# Altium project fMUX_MB.PrjPCB (part 5 of 6)

## Sheet PHY_RJ45.SchDoc: FPGA Motherboard for Digital Multiplexed Readout, McGill U.
size Letter; DocumentNumber: DfMUX11; Revision: Rev0, Prototype; SheetNumber: 11; SheetTotal: 27; PageSetup: Record=PageOptions|CenterHorizontal=True|CenterVertical=True|PrintScale=1.27|XCorrection=1.00|YCorrection=1.00|PrintKind=0|BorderSize=5000000|LeftOffset=0|BottomOffset=0|Orientation=2|PaperLength=1000|PaperWidth=1000|Scale=100|PaperSource=15|PrintQuality=1200|MediaType=1|DitherType=10|PaperKind=Tabloid|PrintScaleMode=1
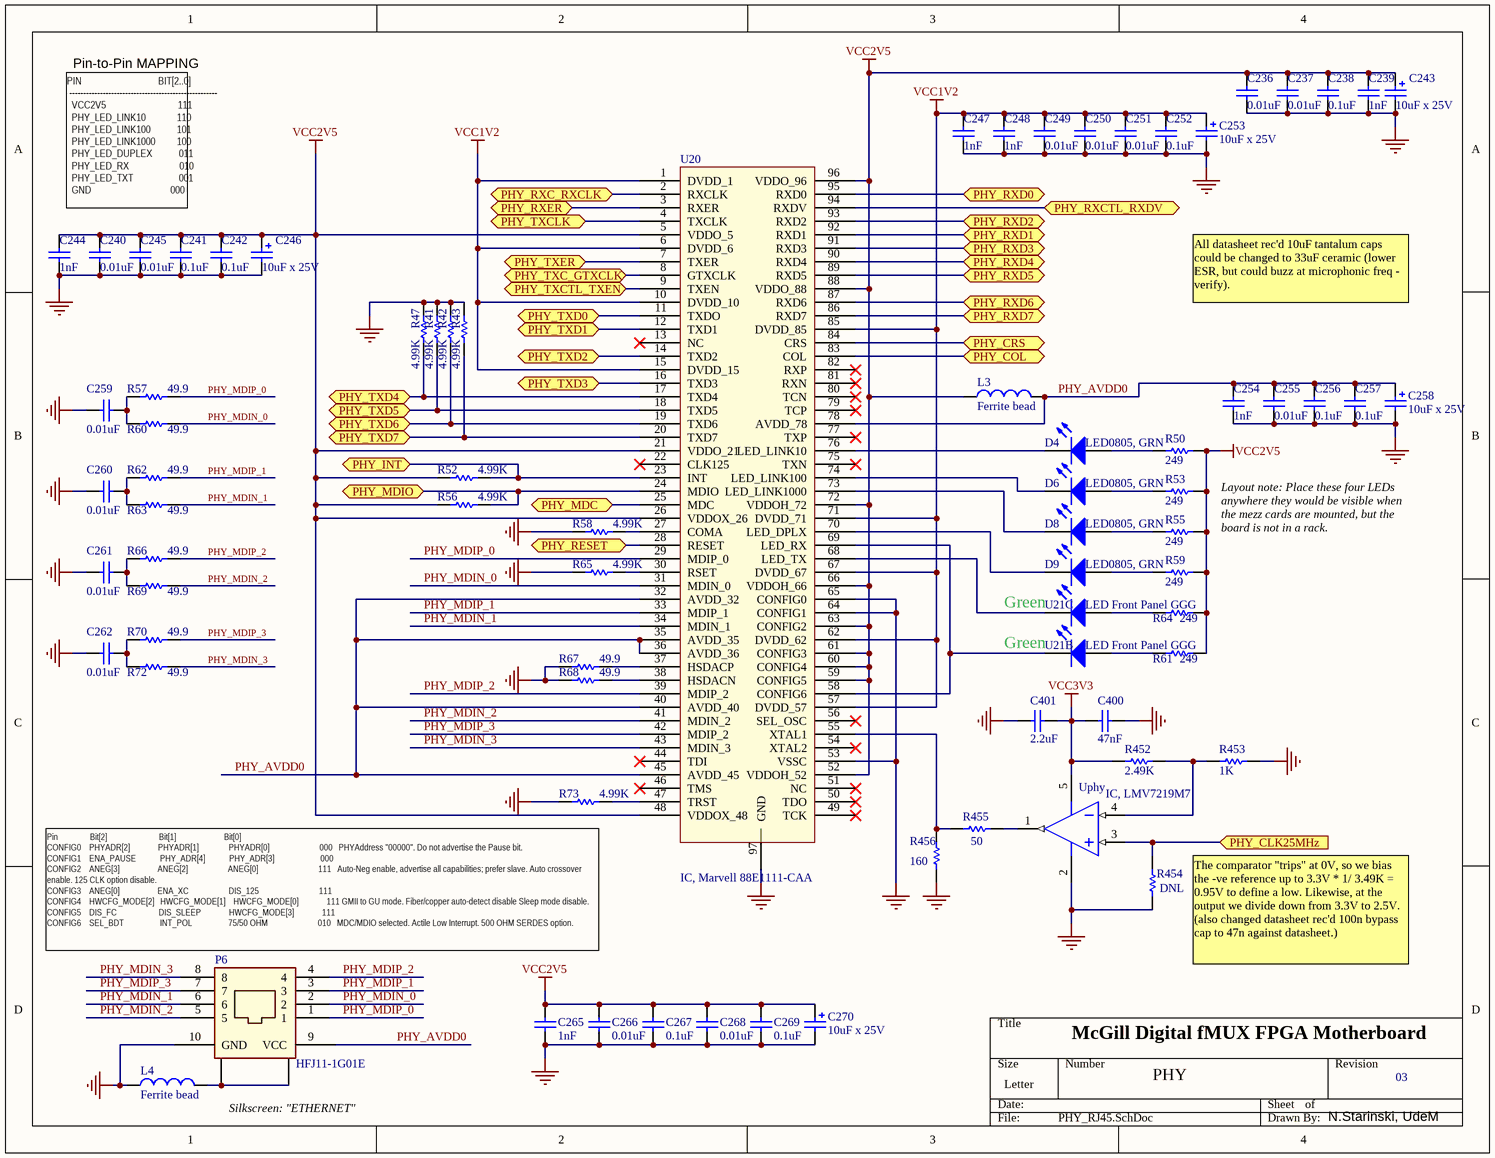
[diagram p26: PHY_RJ45.SchDoc]

### Parts
C236  0.01uF  [CC1005-0402]
C237  0.01uF  [CC1005-0402]
C238  0.1uF  [CC1608-0603]
C239  1nF  [CC1005-0402]
C240  0.01uF  [CC1005-0402]
C241  0.1uF  [CC1608-0603]
C242  0.1uF  [CC1608-0603]
C243  10uF x 25V  [TC6032-2412]
C244  1nF  [CC1005-0402]
C245  0.01uF  [CC1005-0402]
C246  10uF x 25V  [TC6032-2412]
C247  1nF  [CC1005-0402]
C248  1nF  [CC1005-0402]
C249  0.01uF  [CC1005-0402]
C250  0.01uF  [CC1005-0402]
C251  0.01uF  [CC1005-0402]
C252  0.1uF  [CC1608-0603]
C253  10uF x 25V  [TC6032-2412]
C254  1nF  [CC1005-0402]
C255  0.01uF  [CC1005-0402]
C256  0.1uF  [CC1608-0603]
C257  0.1uF  [CC1608-0603]
C258  10uF x 25V  [TC6032-2412]
C259  0.01uF  [CC1608-0603]
C260  0.01uF  [CC1608-0603]
C261  0.01uF  [CC1608-0603]
C262  0.01uF  [CC1608-0603]
C265  1nF  [CC1005-0402]
C266  0.01uF  [CC1005-0402]
C267  0.1uF  [CC1608-0603]
C268  0.01uF  [CC1005-0402]
C269  0.1uF  [CC1608-0603]
C270  10uF x 25V  [TC6032-2412]
C400  47nF  [CC1005-0402]
C401  2.2uF  [CC3225-1210]
D4  LED0805, GRN  [SMD _LED]
D6  LED0805, GRN  [SMD _LED]
D8  LED0805, GRN  [SMD _LED]
D9  LED0805, GRN  [SMD _LED]
L3  Ferrite bead  [INDC2012-0805]
L4  Ferrite bead  [INDC2012-0805]
P6  HFJ11-1G01E  [HALO_RJ45]
R41  4.99K  [CR1608-0603]
R42  4.99K  [CR1608-0603]
R43  4.99K  [CR1608-0603]
R47  4.99K  [CR1608-0603]
R50  249  [CR1608-0603]
R52  4.99K  [CR1608-0603]
R53  249  [CR1608-0603]
R55  249  [CR1608-0603]
R56  4.99K  [CR1608-0603]
R57  49.9  [CR1608-0603]
R58  4.99K  [CR1608-0603]
R59  249  [CR1608-0603]
R60  49.9  [CR1608-0603]
R61  249  [CR1608-0603]
R62  49.9  [CR1608-0603]
R63  49.9  [CR1608-0603]
R64  249  [CR1608-0603]
R65  4.99K  [CR1608-0603]
R66  49.9  [CR1608-0603]
R67  49.9  [CR1608-0603]
R68  49.9  [CR1608-0603]
R69  49.9  [CR1608-0603]
R70  49.9  [CR1608-0603]
R72  49.9  [CR1608-0603]
R73  4.99K  [CR1608-0603]
R452  2.49K  [CR1608-0603]
R453  1K  [CR1608-0603]
R454  DNL  [CR1608-0603]
R455  50  [CR1608-0603]
R456  160  [CR1608-0603]
U20  IC, Marvell 88E1111-CAA  [BCC_96]
U21  LED Front Panel GGG  [LED_Tri_]  (parts B,C of 3)
Uphy  IC, LMV7219M7  [MAA05A]

### Ports
PHY_CLK25MHz (in), PHY_COL (bidir), PHY_CRS (bidir), PHY_INT (bidir), PHY_MDC (bidir), PHY_MDIO (bidir), PHY_RESET (bidir), PHY_RXC_RXCLK (bidir), PHY_RXCTL_RXDV (bidir), PHY_RXD0 (bidir), PHY_RXD1 (bidir), PHY_RXD2 (bidir), PHY_RXD3 (bidir), PHY_RXD4 (bidir), PHY_RXD5 (bidir), PHY_RXD6 (bidir), PHY_RXD7 (bidir), PHY_RXER (bidir), PHY_TXC_GTXCLK (bidir), PHY_TXCLK (bidir), PHY_TXCTL_TXEN (bidir), PHY_TXD0 (bidir), PHY_TXD1 (bidir), PHY_TXD2 (bidir), PHY_TXD3 (bidir), PHY_TXD4 (bidir), PHY_TXD5 (bidir), PHY_TXD6 (bidir), PHY_TXD7 (bidir), PHY_TXER (bidir)

### Nets
GND: C236.1 C237.1 C238.1 C239.1 C240.1 C241.1 C242.1 C243.2 C244.1 C245.1 C246.2 C247.1 C248.1 C249.1 C250.1 C251.1 C252.1 C253.2 C254.1 C255.1 C256.1 C257.1 C258.2 C259.1 C260.1 C261.1 C262.1 C265.1 C266.1 C267.1 C268.1 C269.1 C270.2 C400.2 C401.2 L4.1 P6.10(GND) R41.2 R42.2 R43.2 R47.2 R58.1 R65.1 R67.1 R68.1 R73.1 R453.2 R454.1 R456.1 U20.53(VSSC) U20.64(CONFIG1) U20.65(CONFIG0) U20.97(GND) Uphy.2(V-)
VCC1V2: C247.2 C248.2 C249.2 C250.2 C251.2 C252.2 C253.1 U20.1(DVDD_1) U20.6(DVDD_6) U20.10(DVDD_10) U20.15(DVDD_15) U20.57(DVDD_57) U20.62(DVDD_62) U20.67(DVDD_67) U20.71(DVDD_71) U20.85(DVDD_85)  [project net Vout3]
VCC2V5: C236.2 C237.2 C238.2 C239.2 C240.2 C241.2 C242.2 C243.1 C244.2 C245.2 C246.1 C265.2 C266.2 C267.2 C268.2 C269.2 C270.1 L3.1 R50.2 R52.1 R53.2 R55.2 R56.1 R59.2 R61.2 R64.2 U20.5(VDDO_5) U20.21(VDDO_21) U20.26(VDDOX_26) U20.48(VDDOX_48) U20.52(VDDOH_52) U20.59(CONFIG5) U20.60(CONFIG4) U20.61(CONFIG3) U20.63(CONFIG2) U20.66(VDDOH_66) U20.72(VDDOH_72) U20.88(VDDO_88) U20.96(VDDO_96)  [project net Vout2]
VCC3V3: C400.1 C401.1 R452.1 Uphy.5(V+)
PHY_AVDD0: C254.2 C255.2 C256.2 C257.2 C258.1 L3.2 P6.9(VCC) U20.32(AVDD_32) U20.35(AVDD_35) U20.36(AVDD_36) U20.40(AVDD_40) U20.45(AVDD_45) U20.78(AVDD_78)  [project net PHY_AVDD0_11]
PHY_COL: U20.83(COL) ; port PHY_COL
PHY_CRS: U20.84(CRS) ; port PHY_CRS
PHY_INT: R52.2 U20.23(INT) ; port PHY_INT
PHY_MDC: U20.25(MDC) ; port PHY_MDC
PHY_MDIN_0: P6.2 R60.2 U20.31(MDIN_0)  [project net PHY_MDIN_0_11]
PHY_MDIN_1: P6.6 R63.2 U20.34(MDIN_1)  [project net PHY_MDIN_1_11]
PHY_MDIN_2: P6.5 R69.2 U20.41(MDIN_2)  [project net PHY_MDIN_2_11]
PHY_MDIN_3: P6.8 R72.2 U20.43(MDIN_3)  [project net PHY_MDIN_3_11]
PHY_MDIO: R56.2 U20.24(MDIO) ; port PHY_MDIO
PHY_MDIP_0: P6.1 R57.2 U20.29(MDIP_0)  [project net PHY_MDIP_0_11]
PHY_MDIP_1: P6.3 R62.2 U20.33(MDIP_1)  [project net PHY_MDIP_1_11]
PHY_MDIP_2: P6.4 R66.2 U20.39(MDIP_2)  [project net PHY_MDIP_2_11]
PHY_MDIP_3: P6.7 R70.2 U20.42(MDIP_2)  [project net PHY_MDIP_3_11]
PHY_RESET: U20.28(RESET) ; port PHY_RESET
PHY_RXCTL_RXDV: U20.94(RXDV) ; port PHY_RXCTL_RXDV
PHY_RXD0: U20.95(RXD0) ; port PHY_RXD0
PHY_RXD1: U20.92(RXD1) ; port PHY_RXD1
PHY_RXD2: U20.93(RXD2) ; port PHY_RXD2
PHY_RXD3: U20.91(RXD3) ; port PHY_RXD3
PHY_RXD4: U20.90(RXD4) ; port PHY_RXD4
PHY_RXD5: U20.89(RXD5) ; port PHY_RXD5
PHY_RXD6: U20.87(RXD6) ; port PHY_RXD6
PHY_RXD7: U20.86(RXD7) ; port PHY_RXD7
PHY_RXER: U20.3(RXER) ; port PHY_RXER
PHY_TXC_GTXCLK: U20.8(GTXCLK) ; port PHY_TXC_GTXCLK
PHY_TXCTL_TXEN: U20.9(TXEN) ; port PHY_TXCTL_TXEN
PHY_TXD0: U20.11(TXDO) ; port PHY_TXD0
PHY_TXD1: U20.12(TXD1) ; port PHY_TXD1
PHY_TXD2: U20.14(TXD2) ; port PHY_TXD2
PHY_TXD3: U20.16(TXD3) ; port PHY_TXD3
PHY_TXD4: R47.1 U20.17(TXD4) ; port PHY_TXD4
PHY_TXD5: R41.1 U20.18(TXD5) ; port PHY_TXD5
PHY_TXD6: R42.1 U20.19(TXD6) ; port PHY_TXD6
PHY_TXD7: R43.1 U20.20(TXD7) ; port PHY_TXD7
PHY_TXER: U20.7(TXER) ; port PHY_TXER
SYSCLK_25MHZ: R454.2 Uphy.3(IN+) ; port PHY_CLK25MHz
NetC259_2: C259.2 R57.1 R60.1
NetC260_2: C260.2 R62.1 R63.1
NetC261_2: C261.2 R66.1 R69.1
NetC262_2: C262.2 R70.1 R72.1
NetD4_1: D4.1(A) R50.1
NetD4_2: D4.2(K) U20.76(LED_LINK10)
NetD6_1: D6.1(A) R53.1
NetD6_2: D6.2(K) U20.74(LED_LINK100)
NetD8_1: D8.1(A) R55.1
NetD8_2: D8.2(K) U20.73(LED_LINK1000)
NetD9_1: D9.1(A) R59.1
NetD9_2: D9.2(K) U20.70(LED_DPLX)
NetL4_2: L4.2 P6.11(GND) P6.12(GND)
NetR58_2: R58.2 U20.27(COMA)
NetR61_1: R61.1 U21.A2(A)
NetR64_1: R64.1 U21.A3(A)
NetR65_2: R65.2 U20.30(RSET)
NetR67_2: R67.2 U20.37(HSDACP)
NetR68_2: R68.2 U20.38(HSDACN)
NetR73_2: R73.2 U20.47(TRST)
NetR452_2: R452.2 R453.1 Uphy.4(IN-)
NetR455_1: R455.1 R456.2 U20.55(XTAL1)
NetR455_2: R455.2 Uphy.1(OUT)
NetU1_F18: U20.2(RXCLK) ; port PHY_RXC_RXCLK
NetU1_H19: U20.4(TXCLK) ; port PHY_TXCLK
NetU20_58: U20.58(CONFIG6) U20.69(LED_RX) U21.K2(K)
NetU20_68: U20.68(LED_TX) U21.K3(K)

Not connected (* = marked no-connect by the designer): U20 13(NC)* 22(CLK125)* 44(TDI)* 46(TMS)* 49(TCK)* 50(TDO)* 51(NC)* 54(XTAL2)* 56(SEL_OSC)* 75(TXN)* 77(TXP)* 79(TCP)* 80(TCN)* 81(RXN)* 82(RXP)*

### Notes on the sheet
- Pin-to-Pin MAPPING
- PIN                                BIT[2..0]
  -----------------------------------------------------
  VCC2V5                              111
  PHY_LED_LINK10             110
  PHY_LED_LINK100           101
  PHY_LED_LINK1000         100
  PHY_LED_DUPLEX           011
  PHY_LED_RX                     010
  PHY_LED_TXT                   001
  GND                                 000
- All datasheet rec'd 10uF tantalum caps could be changed to 33uF ceramic (lower ESR, but could buzz at microphonic freq - verify).
- Layout note: Place these four LEDs anywhere they would be visible when the mezz cards are mounted, but the board is not in a rack.
- Green
- (near U21) Green
- Pin                Bit[2]                          Bit[1]                        Bit[0]
  CONFIG0    PHYADR[2]              PHYADR[1]               PHYADR[0]                         000   PHYAddress "00000". Do not advertise the Pause bit.
  CONFIG1    ENA_PAUSE            PHY_ADR[4]            PHY_ADR[3]                       000
  CONFIG2    ANEG[3]                   ANEG[2]                    ANEG[0]                              111   Auto-Neg enable, advertise all capabilities; prefer slave. Auto crossover enable. 125 CLK option disable.
  CONFIG3    ANEG[0]                   ENA_XC                    DIS_125                              111
  CONFIG4    HWCFG_MODE[2]   HWCFG_MODE[1]    HWCFG_MODE[0]              111	GMII to GU mode. Fiber/copper auto-detect disable Sleep mode disable.
  CONFIG5    DIS_FC                     DIS_SLEEP              HWCFG_MODE[3]              111
  CONFIG6    SEL_BDT                  INT_POL                  75/50 OHM                         010   MDC/MDIO selected. Actile Low Interrupt. 500 OHM SERDES option.
- (near R454) The comparator "trips" at 0V, so we bias the -ve reference up to 3.3V * 1/ 3.49K = 0.95V to define a low. Likewise, at the output we divide down from 3.3V to 2.5V. (also changed datasheet rec'd 100n bypass cap to 47n against datasheet.)
- McGill Digital fMUX FPGA Motherboard
- Silkscreen: "ETHERNET"
- PHY
- 03
- N.Starinski, UdeM

### Library data of the parts
C236-C242 C244 C245 C247-C252 C254-C257 C259-C262 C265-C269 C400 = Cap Semi: Capacitor (Semiconductor SIM Model); Published: 8-Jun-2000; LatestRevisionDate: 17-Jul-2002; LatestRevisionNote: Re-released for DXP Platform.; PackageReference: C1206; Publisher: Altium Limited
C243 C246 C253 C258 C270 = Cap Pol3: CAP POL B45197A5106K309; Published: 8-Jun-2000; LatestRevisionDate: 17-Jul-2002; LatestRevisionNote: Re-released for DXP Platform.; PackageReference: C0805; Publisher: Altium Limited
C401 = Cap Semi: Capacitor (use 1206 footprint); Published: 8-Jun-2000; LatestRevisionDate: 17-Jul-2002; LatestRevisionNote: Re-released for DXP Platform.; PackageReference: C1206; Publisher: Altium Limited
D4 D6 D8 D9 = LED3: LED 0805 LTST-C170GKT; Published: 8-Jun-2000; LatestRevisionDate: 17-Dec-2003; LatestRevisionNote: PCB Footprint replaced.; Publisher: Altium Limited
L3 L4 = Inductor: Inductor SM 0805; Code_IEC: 1005; Published: 8-Jun-2000; LatestRevisionDate: 17-Jul-2002; LatestRevisionNote: Re-released for DXP Platform.; PackageReference: 0402-A; Publisher: Altium Limited; Code_JEITA: 0402
P6 = HFJ11-1G01E: Gigabit HALO RJ45
R41-R43 R47 R50 R52 R53 R55-R70 R72 R73 R452 R453 R455 R456 = Res Semi: Resistor 0603; Published: 8-Jun-2000; LatestRevisionDate: 17-Jul-2002; LatestRevisionNote: Re-released for DXP Platform.; Publisher: Altium Limited
R454 = Res Semi: Semiconductor Resistor; Published: 8-Jun-2000; LatestRevisionDate: 17-Jul-2002; LatestRevisionNote: Re-released for DXP Platform.; Publisher: Altium Limited
U20 = M88E1111-CAA: PHY 10/100/1000 Alaska Single-Port Gigabit Transceiver
U21 = LED_Tri: 564-0200-222F
Uphy = LMV7219: Voltage Comparator

## Sheet fMuxBoardOverview.SchDoc: Overview of fMux MotherBoard
size C; Author: Matt.Dobbs@McGill.ca; Revision: 3, Oct 2007; PageSetup: Record=PageOptions|CenterHorizontal=True|CenterVertical=True|PrintScale=0.54|XCorrection=1.00|YCorrection=1.00|PrintKind=2|BorderSize=5000000|LeftOffset=0|BottomOffset=0|Orientation=2|PaperLength=1000|PaperWidth=1000|Scale=100|PaperSource=15|PrintQuality=1200|MediaType=1|DitherType=10|PaperKind=Letter|PrintScaleMode=1
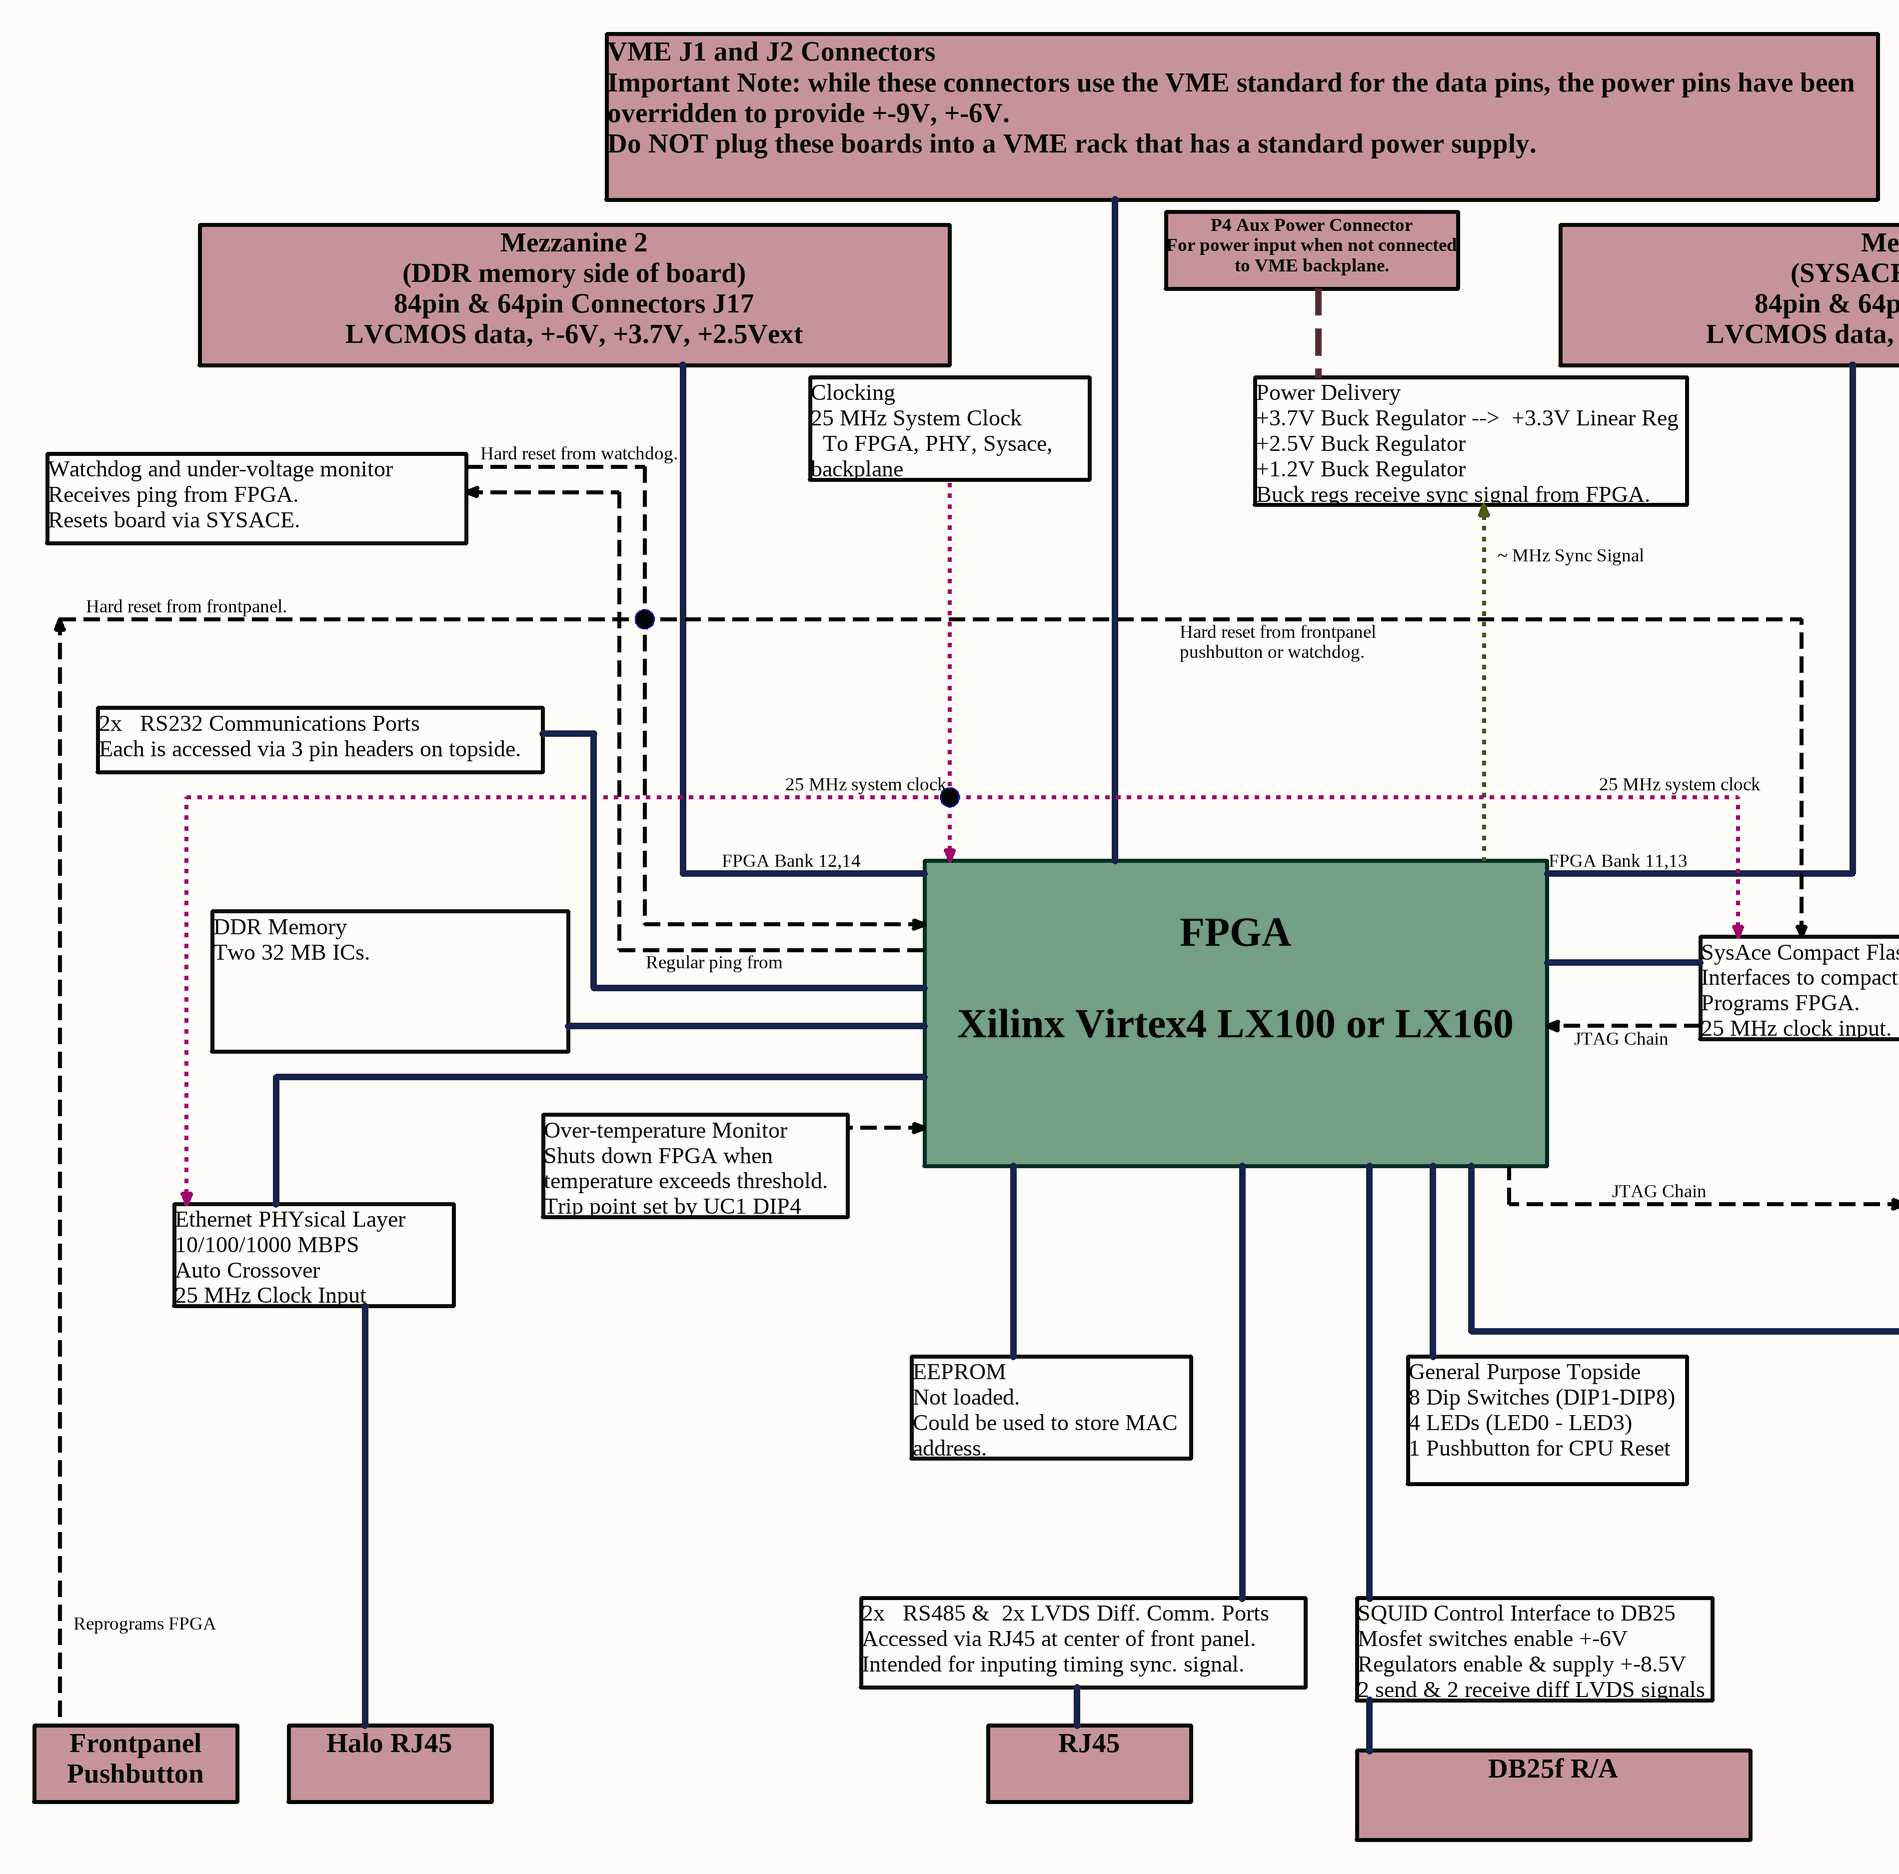
[diagram p27: fMuxBoardOverview.SchDoc, left]
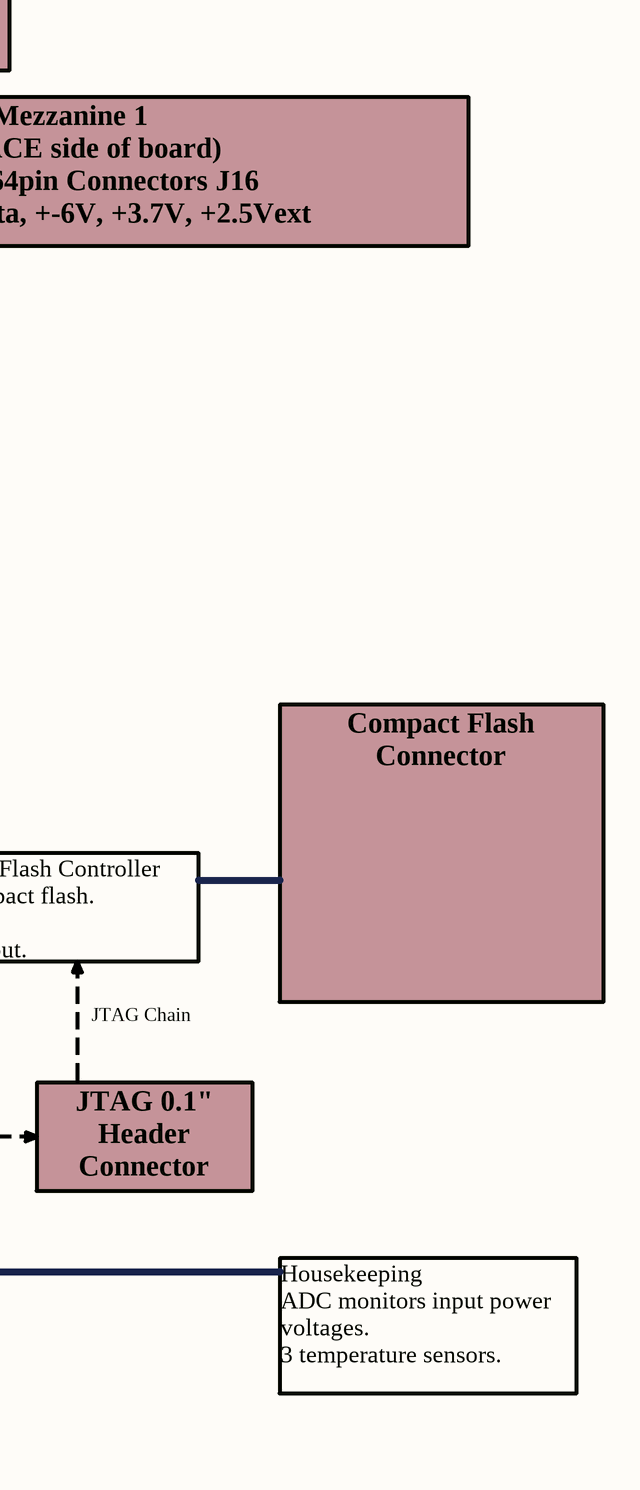
[diagram p28: fMuxBoardOverview.SchDoc, right]

### Notes on the sheet
- VME J1 and J2 Connectors
  Important Note: while these connectors use the VME standard for the data pins, the power pins have been overridden to provide +-9V, +-6V.
  Do NOT plug these boards into a VME rack that has a standard power supply.
- P4 Aux Power Connector
  For power input when not connected to VME backplane.
- Mezzanine 2
  (DDR memory side of board)
  84pin & 64pin Connectors J17
  LVCMOS data, +-6V, +3.7V, +2.5Vext
- Mezzanine 1
  (SYSACE side of board)
  84pin & 64pin Connectors J16
  LVCMOS data, +-6V, +3.7V, +2.5Vext
- Hard reset from watchdog.
- Clocking
  25 MHz System Clock
  To FPGA, PHY, Sysace, backplane
  Sourced from half size (DIP8) socket or backplane.
  To/from backplane as LVCMOS and/or LVDS.
  User Clock to FPGA (not normally used)
- Power Delivery
  +3.7V Buck Regulator -->  +3.3V Linear Reg
  +2.5V Buck Regulator
  +1.2V Buck Regulator
  Buck regs receive sync signal from FPGA.
- Watchdog and under-voltage monitor
  Receives ping from FPGA.
  Resets board via SYSACE.
- ~ MHz Sync Signal
- Hard reset from frontpanel.
- Hard reset from frontpanel pushbutton or watchdog.
- 2x   RS232 Communications Ports
  Each is accessed via 3 pin headers on topside.
- 25 MHz system clock
- FPGA Bank 12,14
- FPGA Bank 11,13
- Regular ping from FPGA (~1 Hz)
- DDR Memory
  Two 32 MB ICs.
- JTAG Chain
- SysAce Compact Flash Controller
  Interfaces to compact flash.
  Programs FPGA.
  25 MHz clock input.
- Compact Flash Connector
- Over-temperature Monitor
  Shuts down FPGA when temperature exceeds threshold. Trip point set by UC1 DIP4 switch.
- FPGA
  Xilinx Virtex4 LX100 or LX160
- JTAG 0.1" Header Connector
- Ethernet PHYsical Layer
  10/100/1000 MBPS
  Auto Crossover
  25 MHz Clock Input
- EEPROM
  Not loaded.
  Could be used to store MAC address.
- Housekeeping
  ADC monitors input power voltages.
  3 temperature sensors.
- General Purpose Topside
  8 Dip Switches (DIP1-DIP8)
  4 LEDs (LED0 - LED3)
  1 Pushbutton for CPU Reset
- Reprograms FPGA with SYSACE
- 2x   RS485 &  2x LVDS Diff. Comm. Ports
  Accessed via RJ45 at center of front panel.
  Intended for inputing timing sync. signal.
- SQUID Control Interface to DB25
  Mosfet switches enable +-6V
  Regulators enable & supply +-8.5V
  2 send & 2 receive diff LVDS signals
- Frontpanel
  Pushbutton
- Halo RJ45
- RJ45
- DB25f R/A